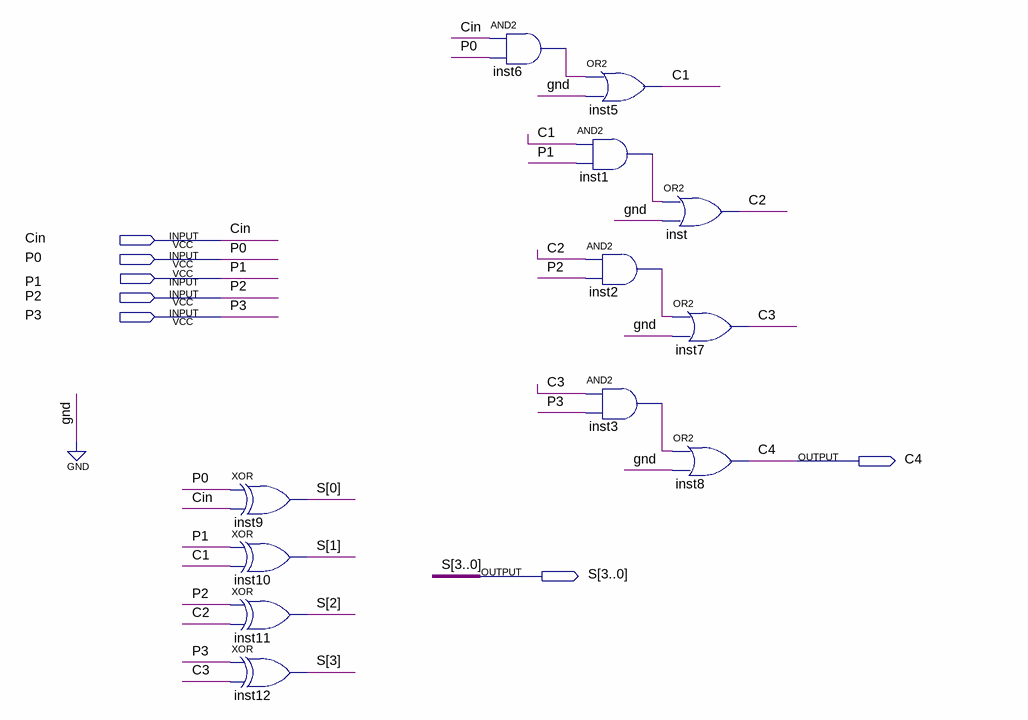
[diagram p0: schematic sheet]
// Quartus schematic Carryo.bdf as structural Verilog: 12 symbols, 7 pins
module Carryo (
  input  Cin,
  input  P0,
  input  P1,
  input  P2,
  input  P3,
  output C4,
  output [3:0] S
);

  wire C1, C2, C3, inst1_out, inst2_out, inst3_out, inst6_out;

  xor inst9 (S[0], P0, Cin);
  xor inst10 (S[1], P1, C1);
  xor inst11 (S[2], P2, C2);
  xor inst12 (S[3], P3, C3);
  and inst6 (inst6_out, Cin, P0);
  or inst5 (C1, inst6_out, 1'b0);
  and inst1 (inst1_out, C1, P1);
  and inst2 (inst2_out, C2, P2);
  and inst3 (inst3_out, C3, P3);
  or inst (C2, inst1_out, 1'b0);
  or inst7 (C3, inst2_out, 1'b0);
  or inst8 (C4, inst3_out, 1'b0);
endmodule
